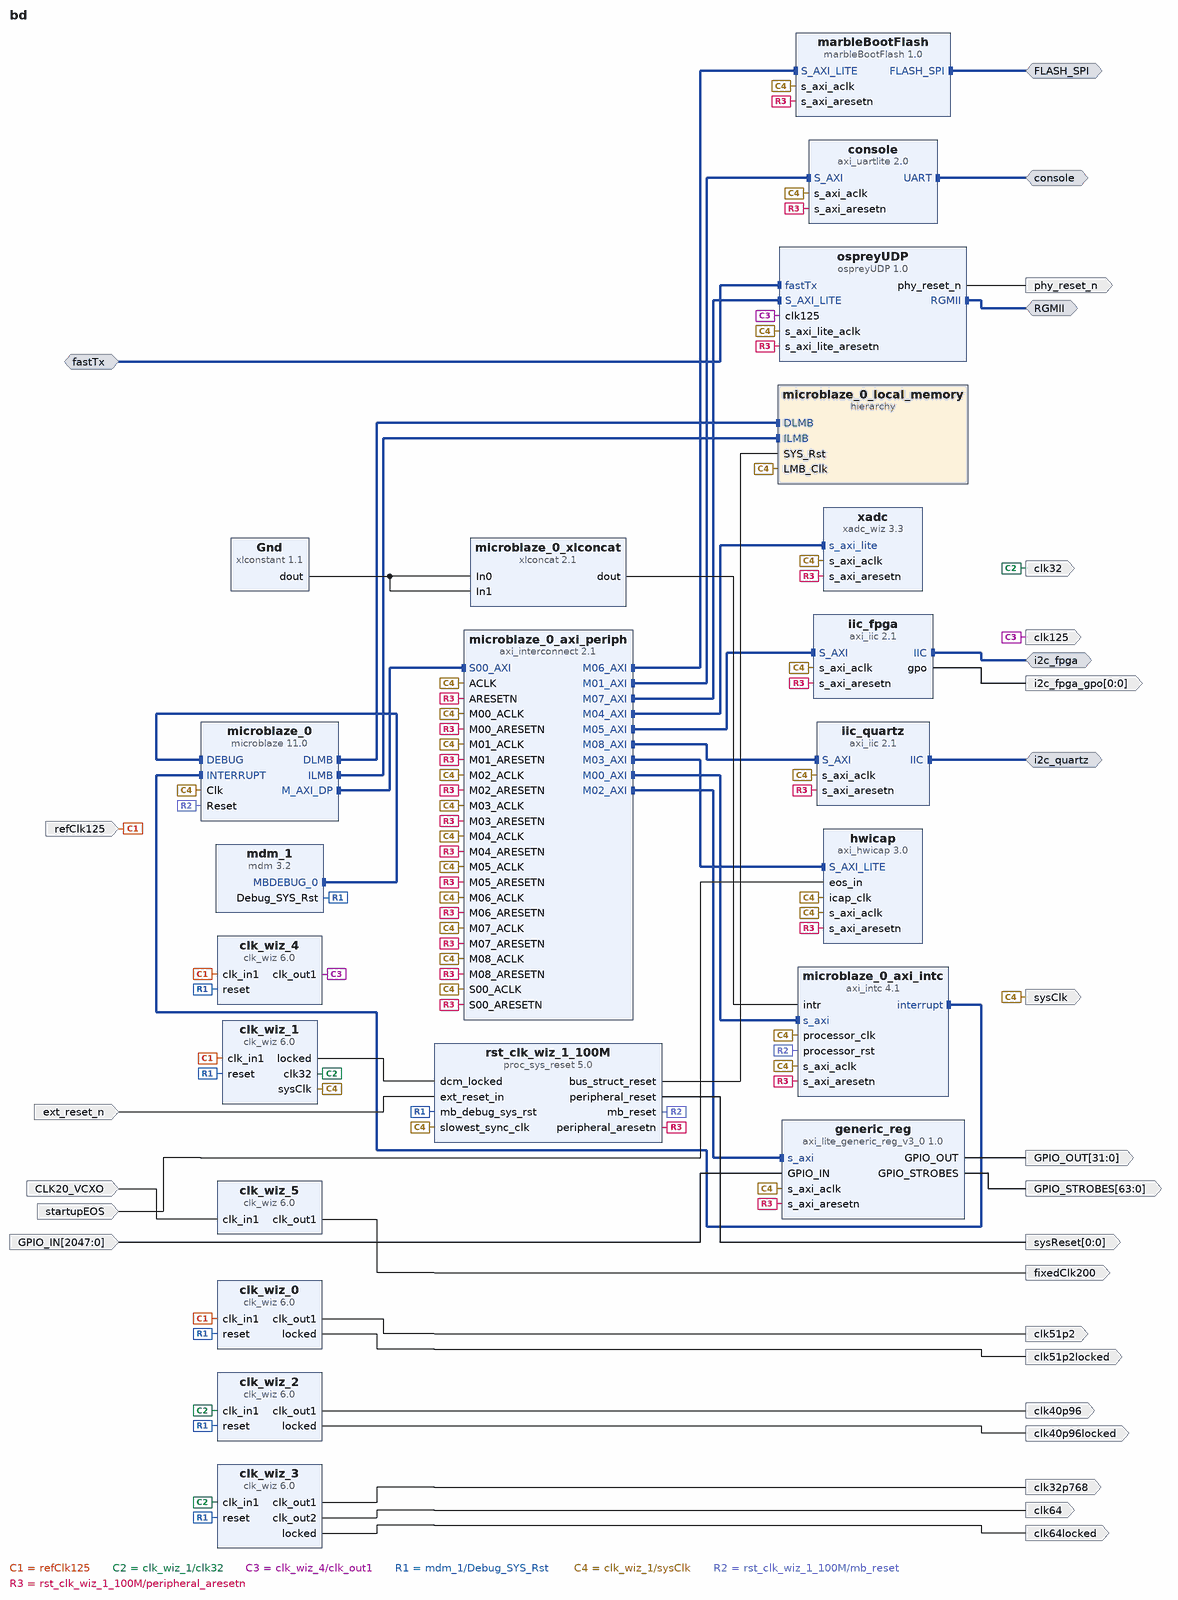
[diagram p0: block diagram of the top level]
# Vivado block design bd, xc7k160tffg676-2, Vivado 2023.1
create_bd_design bd

create_bd_intf_port -mode Master -vlnv xilinx.com:interface:uart_rtl:1.0 console
create_bd_intf_port -mode Master -vlnv xilinx.com:interface:iic_rtl:1.0 i2c_fpga
create_bd_intf_port -mode Master -vlnv OspreyDCS:user:FLASH_SPI_rtl:1.1 FLASH_SPI
create_bd_intf_port -mode Slave -vlnv xilinx.com:interface:axis_rtl:1.0 fastTx
set_property -dict [list \
  CONFIG.HAS_TKEEP 0 \
  CONFIG.HAS_TLAST 1 \
  CONFIG.HAS_TREADY 1 \
  CONFIG.HAS_TSTRB 0 \
  CONFIG.LAYERED_METADATA undef \
  CONFIG.TDATA_NUM_BYTES 1 \
  CONFIG.TDEST_WIDTH 0 \
  CONFIG.TID_WIDTH 0 \
  CONFIG.TUSER_WIDTH 0 \
] [get_bd_intf_ports fastTx]
create_bd_intf_port -mode Master -vlnv xilinx.com:interface:rgmii_rtl:1.0 RGMII
create_bd_intf_port -mode Master -vlnv xilinx.com:interface:iic_rtl:1.0 i2c_quartz
create_bd_port -dir I -type rst ext_reset_n
set_property -dict {CONFIG.POLARITY ACTIVE_LOW} [get_bd_ports ext_reset_n]
create_bd_port -dir O -type clk sysClk
create_bd_port -dir O -from 0 -to 0 -type rst sysReset
create_bd_port -dir O -from 63 -to 0 GPIO_STROBES
create_bd_port -dir O -from 31 -to 0 GPIO_OUT
create_bd_port -dir I -from 2047 -to 0 GPIO_IN
create_bd_port -dir O phy_reset_n
create_bd_port -dir O -from 0 -to 0 i2c_fpga_gpo
create_bd_port -dir O -type clk clk51p2
create_bd_port -dir O -type clk clk40p96
create_bd_port -dir O -type clk clk32p768
create_bd_port -dir O -type clk clk125
set_property -dict {CONFIG.ASSOCIATED_BUSIF fastTx} [get_bd_ports clk125]
create_bd_port -dir I -type clk CLK20_VCXO
set_property -dict {CONFIG.FREQ_HZ 20000000} [get_bd_ports CLK20_VCXO]
create_bd_port -dir O -type clk fixedClk200
create_bd_port -dir O -type clk clk64
create_bd_port -dir O -type clk clk32
set_property -dict {CONFIG.FREQ_HZ 32000000} [get_bd_ports clk32]
create_bd_port -dir I -type clk refClk125
set_property -dict {CONFIG.FREQ_HZ 125000000} [get_bd_ports refClk125]
create_bd_port -dir I startupEOS
create_bd_port -dir O clk51p2locked
create_bd_port -dir O clk40p96locked
create_bd_port -dir O clk64locked

create_bd_cell -type ip -vlnv xilinx.com:ip:microblaze:11.0 microblaze_0
set_property -dict [list \
  CONFIG.C_DEBUG_ENABLED 1 \
  CONFIG.C_D_AXI 1 \
  CONFIG.C_D_LMB 1 \
  CONFIG.C_I_LMB 1 \
  CONFIG.C_USE_BARREL 1 \
  CONFIG.C_USE_DIV 1 \
  CONFIG.C_USE_HW_MUL 1 \
  CONFIG.C_USE_MSR_INSTR 1 \
  CONFIG.C_USE_PCMP_INSTR 1 \
] [get_bd_cells microblaze_0]
create_bd_cell -type hier microblaze_0_local_memory
create_bd_cell -type ip -vlnv xilinx.com:ip:axi_intc:4.1 microblaze_0_axi_intc
set_property -dict {CONFIG.C_HAS_FAST 1} [get_bd_cells microblaze_0_axi_intc]
create_bd_cell -type ip -vlnv xilinx.com:ip:xlconcat:2.1 microblaze_0_xlconcat
create_bd_cell -type ip -vlnv xilinx.com:ip:mdm:3.2 mdm_1
create_bd_cell -type ip -vlnv xilinx.com:ip:clk_wiz:6.0 clk_wiz_1
set_property -dict [list \
  CONFIG.CLKIN1_JITTER_PS 80.0 \
  CONFIG.CLKOUT1_DRIVES BUFG \
  CONFIG.CLKOUT1_JITTER 265.121 \
  CONFIG.CLKOUT1_PHASE_ERROR 265.359 \
  CONFIG.CLKOUT2_DRIVES BUFG \
  CONFIG.CLKOUT2_JITTER 338.714 \
  CONFIG.CLKOUT2_PHASE_ERROR 265.359 \
  CONFIG.CLKOUT2_REQUESTED_OUT_FREQ 32 \
  CONFIG.CLKOUT2_USED true \
  CONFIG.CLKOUT3_DRIVES BUFG \
  CONFIG.CLKOUT3_JITTER 233.189 \
  CONFIG.CLKOUT3_PHASE_ERROR 265.359 \
  CONFIG.CLKOUT3_REQUESTED_OUT_FREQ 200 \
  CONFIG.CLKOUT3_USED false \
  CONFIG.CLKOUT4_DRIVES BUFG \
  CONFIG.CLKOUT5_DRIVES BUFG \
  CONFIG.CLKOUT6_DRIVES BUFG \
  CONFIG.CLKOUT7_DRIVES BUFG \
  CONFIG.CLK_OUT1_PORT sysClk \
  CONFIG.CLK_OUT2_PORT clk32 \
  CONFIG.CLK_OUT3_PORT clk200 \
  CONFIG.MMCM_CLKFBOUT_MULT_F 32.000 \
  CONFIG.MMCM_CLKIN1_PERIOD 8.000 \
  CONFIG.MMCM_CLKIN2_PERIOD 10.000 \
  CONFIG.MMCM_CLKOUT0_DIVIDE_F 8.000 \
  CONFIG.MMCM_CLKOUT1_DIVIDE 25 \
  CONFIG.MMCM_CLKOUT2_DIVIDE 1 \
  CONFIG.MMCM_DIVCLK_DIVIDE 5 \
  CONFIG.NUM_OUT_CLKS 2 \
  CONFIG.PRIM_IN_FREQ 125 \
  CONFIG.PRIM_SOURCE Global_buffer \
  CONFIG.SECONDARY_SOURCE Single_ended_clock_capable_pin \
  CONFIG.USE_PHASE_ALIGNMENT false \
  CONFIG.USE_RESET true \
] [get_bd_cells clk_wiz_1]
create_bd_cell -type ip -vlnv xilinx.com:ip:proc_sys_reset:5.0 rst_clk_wiz_1_100M
create_bd_cell -type ip -vlnv xilinx.com:ip:axi_uartlite:2.0 console
set_property -dict {CONFIG.C_BAUDRATE 115200} [get_bd_cells console]
create_bd_cell -type ip -vlnv xilinx.com:ip:xlconstant:1.1 Gnd
set_property -dict {CONFIG.CONST_VAL 0} [get_bd_cells Gnd]
create_bd_cell -type ip -vlnv xilinx.com:ip:axi_hwicap:3.0 hwicap
create_bd_cell -type ip -vlnv xilinx.com:ip:xadc_wiz:3.3 xadc
set_property -dict [list \
  CONFIG.ADC_CONVERSION_RATE 100 \
  CONFIG.AVERAGE_ENABLE_TEMPERATURE true \
  CONFIG.AVERAGE_ENABLE_VBRAM true \
  CONFIG.AVERAGE_ENABLE_VCCAUX true \
  CONFIG.AVERAGE_ENABLE_VCCINT true \
  CONFIG.CHANNEL_ENABLE_CALIBRATION true \
  CONFIG.CHANNEL_ENABLE_TEMPERATURE true \
  CONFIG.CHANNEL_ENABLE_VBRAM true \
  CONFIG.CHANNEL_ENABLE_VCCAUX true \
  CONFIG.CHANNEL_ENABLE_VCCINT true \
  CONFIG.CHANNEL_ENABLE_VP_VN false \
  CONFIG.EXTERNAL_MUX_CHANNEL VP_VN \
  CONFIG.OT_ALARM false \
  CONFIG.SEQUENCER_MODE Continuous \
  CONFIG.SINGLE_CHANNEL_SELECTION TEMPERATURE \
  CONFIG.USER_TEMP_ALARM false \
  CONFIG.VCCAUX_ALARM false \
  CONFIG.VCCINT_ALARM false \
  CONFIG.XADC_STARUP_SELECTION channel_sequencer \
] [get_bd_cells xadc]
create_bd_cell -type ip -vlnv xilinx.com:ip:axi_iic:2.1 iic_fpga
set_property -dict {CONFIG.C_SCL_INERTIAL_DELAY 30 CONFIG.C_SDA_INERTIAL_DELAY 30} [get_bd_cells iic_fpga]
create_bd_cell -type ip -vlnv ospreydcs.com:user:axi_lite_generic_reg_v3_0:1.0 generic_reg
set_property -dict {CONFIG.C_S_AXI_ADDR_WIDTH 8} [get_bd_cells generic_reg]
create_bd_cell -type ip -vlnv xilinx.com:ip:clk_wiz:6.0 clk_wiz_0
set_property -dict [list \
  CONFIG.CLKOUT1_JITTER 304.149 \
  CONFIG.CLKOUT1_PHASE_ERROR 265.359 \
  CONFIG.CLKOUT1_REQUESTED_OUT_FREQ 51.2 \
  CONFIG.MMCM_CLKFBOUT_MULT_F 32.000 \
  CONFIG.MMCM_CLKOUT0_DIVIDE_F 15.625 \
  CONFIG.MMCM_DIVCLK_DIVIDE 5 \
  CONFIG.PRIM_SOURCE Global_buffer \
  CONFIG.USE_LOCKED true \
] [get_bd_cells clk_wiz_0]
create_bd_cell -type ip -vlnv xilinx.com:ip:clk_wiz:6.0 clk_wiz_2
set_property -dict [list \
  CONFIG.CLKIN1_JITTER_PS 312.5 \
  CONFIG.CLKOUT1_JITTER 258.106 \
  CONFIG.CLKOUT1_PHASE_ERROR 198.711 \
  CONFIG.CLKOUT1_REQUESTED_OUT_FREQ 40.96 \
  CONFIG.MMCM_CLKFBOUT_MULT_F 32.000 \
  CONFIG.MMCM_CLKIN1_PERIOD 31.250 \
  CONFIG.MMCM_CLKIN2_PERIOD 10.0 \
  CONFIG.MMCM_CLKOUT0_DIVIDE_F 25.000 \
  CONFIG.MMCM_DIVCLK_DIVIDE 1 \
  CONFIG.PRIM_SOURCE Global_buffer \
  CONFIG.USE_LOCKED true \
] [get_bd_cells clk_wiz_2]
create_bd_cell -type ip -vlnv xilinx.com:ip:clk_wiz:6.0 clk_wiz_3
set_property -dict [list \
  CONFIG.CLKOUT1_JITTER 278.816 \
  CONFIG.CLKOUT1_PHASE_ERROR 198.711 \
  CONFIG.CLKOUT1_REQUESTED_OUT_FREQ 32.768 \
  CONFIG.CLKOUT2_JITTER 225.122 \
  CONFIG.CLKOUT2_PHASE_ERROR 198.711 \
  CONFIG.CLKOUT2_REQUESTED_OUT_FREQ 64 \
  CONFIG.CLKOUT2_USED true \
  CONFIG.MMCM_CLKFBOUT_MULT_F 32.000 \
  CONFIG.MMCM_CLKOUT0_DIVIDE_F 31.250 \
  CONFIG.MMCM_CLKOUT1_DIVIDE 16 \
  CONFIG.MMCM_DIVCLK_DIVIDE 1 \
  CONFIG.NUM_OUT_CLKS 2 \
  CONFIG.PRIM_SOURCE Global_buffer \
  CONFIG.USE_LOCKED true \
] [get_bd_cells clk_wiz_3]
create_bd_cell -type ip -vlnv xilinx.com:ip:clk_wiz:6.0 clk_wiz_4
set_property -dict [list \
  CONFIG.CLKOUT1_JITTER 119.348 \
  CONFIG.CLKOUT1_REQUESTED_OUT_FREQ 125 \
  CONFIG.MMCM_CLKOUT0_DIVIDE_F 8.000 \
  CONFIG.PRIM_SOURCE Global_buffer \
  CONFIG.USE_LOCKED false \
] [get_bd_cells clk_wiz_4]
create_bd_cell -type ip -vlnv xilinx.com:ip:clk_wiz:6.0 clk_wiz_5
set_property -dict [list \
  CONFIG.CLKOUT1_JITTER 237.367 \
  CONFIG.CLKOUT1_REQUESTED_OUT_FREQ 200 \
  CONFIG.MMCM_CLKOUT0_DIVIDE_F 5.000 \
  CONFIG.USE_LOCKED false \
  CONFIG.USE_RESET false \
] [get_bd_cells clk_wiz_5]
create_bd_cell -type ip -vlnv user.org:user:ospreyUDP:1.0 ospreyUDP
set_property -dict [list \
  CONFIG.DEBUG_RX_MAC false \
  CONFIG.DEBUG_TX_FAST false \
  CONFIG.DEBUG_TX_MAC false \
  CONFIG.DEBUG_TX_UDP false \
  CONFIG.ENABLE_ICMP_ECHO false \
  CONFIG.RX_FIFO_DEPTH 16384 \
] [get_bd_cells ospreyUDP]
create_bd_cell -type ip -vlnv user.org:user:marbleBootFlash:1.0 marbleBootFlash
set_property -dict {CONFIG.DEBUG false} [get_bd_cells marbleBootFlash]
create_bd_cell -type ip -vlnv xilinx.com:ip:axi_iic:2.1 iic_quartz
set_property -dict {CONFIG.C_SCL_INERTIAL_DELAY 30 CONFIG.C_SDA_INERTIAL_DELAY 30} [get_bd_cells iic_quartz]
create_bd_cell -type ip -vlnv xilinx.com:ip:axi_interconnect:2.1 microblaze_0_axi_periph
set_property -dict {CONFIG.NUM_MI 9} [get_bd_cells microblaze_0_axi_periph]

# ---- hierarchy /microblaze_0_local_memory ----
current_bd_instance /microblaze_0_local_memory
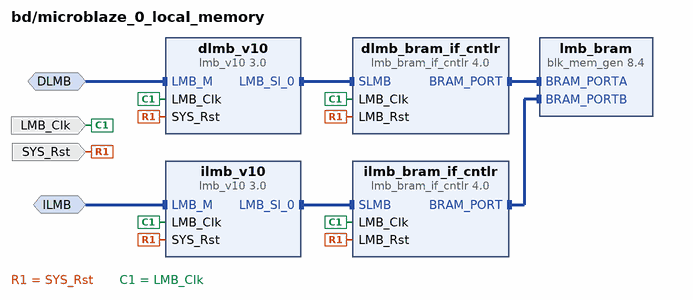
[diagram p1: block diagram inside /microblaze_0_local_memory]
create_bd_intf_pin -mode MirroredMaster -vlnv xilinx.com:interface:lmb_rtl:1.0 DLMB
create_bd_intf_pin -mode MirroredMaster -vlnv xilinx.com:interface:lmb_rtl:1.0 ILMB
create_bd_pin -dir I -type clk LMB_Clk
create_bd_pin -dir I -type rst SYS_Rst

create_bd_cell -type ip -vlnv xilinx.com:ip:lmb_v10:3.0 dlmb_v10
create_bd_cell -type ip -vlnv xilinx.com:ip:lmb_v10:3.0 ilmb_v10
create_bd_cell -type ip -vlnv xilinx.com:ip:lmb_bram_if_cntlr:4.0 dlmb_bram_if_cntlr
set_property -dict {CONFIG.C_ECC 0} [get_bd_cells dlmb_bram_if_cntlr]
create_bd_cell -type ip -vlnv xilinx.com:ip:lmb_bram_if_cntlr:4.0 ilmb_bram_if_cntlr
set_property -dict {CONFIG.C_ECC 0} [get_bd_cells ilmb_bram_if_cntlr]
create_bd_cell -type ip -vlnv xilinx.com:ip:blk_mem_gen:8.4 lmb_bram
set_property -dict {CONFIG.Memory_Type True_Dual_Port_RAM CONFIG.use_bram_block BRAM_Controller} [get_bd_cells lmb_bram]

# ---- connections ----

current_bd_instance /microblaze_0_local_memory
connect_bd_intf_net -intf_net microblaze_0_dlmb [get_bd_intf_pins dlmb_v10/LMB_M] [get_bd_intf_pins DLMB]
connect_bd_intf_net -intf_net microblaze_0_dlmb_bus [get_bd_intf_pins dlmb_v10/LMB_Sl_0] [get_bd_intf_pins dlmb_bram_if_cntlr/SLMB]
connect_bd_intf_net -intf_net microblaze_0_dlmb_cntlr [get_bd_intf_pins dlmb_bram_if_cntlr/BRAM_PORT] [get_bd_intf_pins lmb_bram/BRAM_PORTA]
connect_bd_intf_net -intf_net microblaze_0_ilmb [get_bd_intf_pins ilmb_v10/LMB_M] [get_bd_intf_pins ILMB]
connect_bd_intf_net -intf_net microblaze_0_ilmb_bus [get_bd_intf_pins ilmb_v10/LMB_Sl_0] [get_bd_intf_pins ilmb_bram_if_cntlr/SLMB]
connect_bd_intf_net -intf_net microblaze_0_ilmb_cntlr [get_bd_intf_pins ilmb_bram_if_cntlr/BRAM_PORT] [get_bd_intf_pins lmb_bram/BRAM_PORTB]
connect_bd_net [get_bd_pins SYS_Rst] \
  [get_bd_pins dlmb_v10/SYS_Rst] [get_bd_pins dlmb_bram_if_cntlr/LMB_Rst] [get_bd_pins ilmb_v10/SYS_Rst] \
  [get_bd_pins ilmb_bram_if_cntlr/LMB_Rst]
connect_bd_net -net microblaze_0_Clk [get_bd_pins LMB_Clk] \
  [get_bd_pins dlmb_v10/LMB_Clk] [get_bd_pins dlmb_bram_if_cntlr/LMB_Clk] [get_bd_pins ilmb_v10/LMB_Clk] \
  [get_bd_pins ilmb_bram_if_cntlr/LMB_Clk]
set_property HDL_ATTRIBUTE.BMM_INFO_ADDRESS_SPACE {byte  0x00000000 32 > bd microblaze_0_local_memory/lmb_bram} [get_bd_cells dlmb_bram_if_cntlr]
set_property HDL_ATTRIBUTE.KEEP_HIERARCHY yes [get_bd_cells dlmb_bram_if_cntlr]

current_bd_instance /
connect_bd_intf_net -intf_net axi_iic_0_IIC [get_bd_intf_ports i2c_fpga] [get_bd_intf_pins iic_fpga/IIC]
connect_bd_intf_net -intf_net axi_iic_0_IIC1 [get_bd_intf_ports i2c_quartz] [get_bd_intf_pins iic_quartz/IIC]
connect_bd_intf_net -intf_net axi_uartlite_0_UART [get_bd_intf_ports console] [get_bd_intf_pins console/UART]
connect_bd_intf_net -intf_net fastTx_0_1 [get_bd_intf_ports fastTx] [get_bd_intf_pins ospreyUDP/fastTx]
connect_bd_intf_net [get_bd_intf_ports FLASH_SPI] [get_bd_intf_pins marbleBootFlash/FLASH_SPI]
connect_bd_intf_net -intf_net microblaze_0_axi_dp [get_bd_intf_pins microblaze_0_axi_periph/S00_AXI] [get_bd_intf_pins microblaze_0/M_AXI_DP]
connect_bd_intf_net [get_bd_intf_pins microblaze_0_axi_periph/M01_AXI] [get_bd_intf_pins console/S_AXI]
connect_bd_intf_net [get_bd_intf_pins microblaze_0_axi_periph/M02_AXI] [get_bd_intf_pins generic_reg/s_axi]
connect_bd_intf_net [get_bd_intf_pins microblaze_0_axi_periph/M03_AXI] [get_bd_intf_pins hwicap/S_AXI_LITE]
connect_bd_intf_net [get_bd_intf_pins microblaze_0_axi_periph/M04_AXI] [get_bd_intf_pins xadc/s_axi_lite]
connect_bd_intf_net [get_bd_intf_pins microblaze_0_axi_periph/M05_AXI] [get_bd_intf_pins iic_fpga/S_AXI]
connect_bd_intf_net [get_bd_intf_pins microblaze_0_axi_periph/M06_AXI] [get_bd_intf_pins marbleBootFlash/S_AXI_LITE]
connect_bd_intf_net [get_bd_intf_pins microblaze_0_axi_periph/M07_AXI] [get_bd_intf_pins ospreyUDP/S_AXI_LITE]
connect_bd_intf_net [get_bd_intf_pins microblaze_0_axi_periph/M08_AXI] [get_bd_intf_pins iic_quartz/S_AXI]
connect_bd_intf_net [get_bd_intf_pins mdm_1/MBDEBUG_0] [get_bd_intf_pins microblaze_0/DEBUG]
connect_bd_intf_net [get_bd_intf_pins microblaze_0/DLMB] [get_bd_intf_pins microblaze_0_local_memory/DLMB]
connect_bd_intf_net [get_bd_intf_pins microblaze_0/ILMB] [get_bd_intf_pins microblaze_0_local_memory/ILMB]
connect_bd_intf_net -intf_net microblaze_0_intc_axi [get_bd_intf_pins microblaze_0_axi_periph/M00_AXI] [get_bd_intf_pins microblaze_0_axi_intc/s_axi]
connect_bd_intf_net [get_bd_intf_pins microblaze_0_axi_intc/interrupt] [get_bd_intf_pins microblaze_0/INTERRUPT]
connect_bd_intf_net -intf_net ospreyUDP_0_RGMII [get_bd_intf_ports RGMII] [get_bd_intf_pins ospreyUDP/RGMII]
connect_bd_net -net GPIO_IN_0_1 [get_bd_ports GPIO_IN] [get_bd_pins generic_reg/GPIO_IN]
connect_bd_net [get_bd_pins Gnd/dout] [get_bd_pins microblaze_0_xlconcat/In0] [get_bd_pins microblaze_0_xlconcat/In1]
connect_bd_net -net axi_lite_generic_reg_0_GPIO_OUT [get_bd_pins generic_reg/GPIO_OUT] [get_bd_ports GPIO_OUT]
connect_bd_net -net axi_lite_generic_reg_0_GPIO_STROBES [get_bd_pins generic_reg/GPIO_STROBES] [get_bd_ports GPIO_STROBES]
connect_bd_net -net clk_in1_0_1 [get_bd_ports CLK20_VCXO] [get_bd_pins clk_wiz_5/clk_in1]
connect_bd_net -net clk_in1_0_2 [get_bd_ports refClk125] \
  [get_bd_pins clk_wiz_1/clk_in1] [get_bd_pins clk_wiz_4/clk_in1] [get_bd_pins clk_wiz_0/clk_in1]
connect_bd_net [get_bd_pins clk_wiz_0/clk_out1] [get_bd_ports clk51p2]
connect_bd_net [get_bd_pins clk_wiz_0/locked] [get_bd_ports clk51p2locked]
connect_bd_net [get_bd_pins clk_wiz_1/clk32] [get_bd_pins clk_wiz_2/clk_in1] [get_bd_pins clk_wiz_3/clk_in1] [get_bd_ports clk32]
connect_bd_net [get_bd_pins clk_wiz_1/locked] [get_bd_pins rst_clk_wiz_1_100M/dcm_locked]
connect_bd_net [get_bd_pins clk_wiz_2/clk_out1] [get_bd_ports clk40p96]
connect_bd_net [get_bd_pins clk_wiz_2/locked] [get_bd_ports clk40p96locked]
connect_bd_net [get_bd_pins clk_wiz_3/clk_out1] [get_bd_ports clk32p768]
connect_bd_net [get_bd_pins clk_wiz_3/clk_out2] [get_bd_ports clk64]
connect_bd_net [get_bd_pins clk_wiz_3/locked] [get_bd_ports clk64locked]
connect_bd_net [get_bd_pins clk_wiz_4/clk_out1] [get_bd_ports clk125] [get_bd_pins ospreyUDP/clk125]
connect_bd_net [get_bd_pins clk_wiz_5/clk_out1] [get_bd_ports fixedClk200]
connect_bd_net -net eos_in_0_1 [get_bd_ports startupEOS] [get_bd_pins hwicap/eos_in]
connect_bd_net [get_bd_pins iic_fpga/gpo] [get_bd_ports i2c_fpga_gpo]
connect_bd_net [get_bd_pins mdm_1/Debug_SYS_Rst] \
  [get_bd_pins rst_clk_wiz_1_100M/mb_debug_sys_rst] [get_bd_pins clk_wiz_1/reset] [get_bd_pins clk_wiz_0/reset] \
  [get_bd_pins clk_wiz_2/reset] [get_bd_pins clk_wiz_3/reset] [get_bd_pins clk_wiz_4/reset]
connect_bd_net -net microblaze_0_Clk [get_bd_pins clk_wiz_1/sysClk] \
  [get_bd_pins microblaze_0/Clk] [get_bd_pins microblaze_0_axi_intc/s_axi_aclk] \
  [get_bd_pins microblaze_0_axi_intc/processor_clk] [get_bd_pins microblaze_0_local_memory/LMB_Clk] \
  [get_bd_pins rst_clk_wiz_1_100M/slowest_sync_clk] [get_bd_pins console/s_axi_aclk] [get_bd_ports sysClk] \
  [get_bd_pins hwicap/s_axi_aclk] [get_bd_pins xadc/s_axi_aclk] [get_bd_pins hwicap/icap_clk] \
  [get_bd_pins iic_fpga/s_axi_aclk] [get_bd_pins generic_reg/s_axi_aclk] [get_bd_pins ospreyUDP/s_axi_lite_aclk] \
  [get_bd_pins marbleBootFlash/s_axi_aclk] [get_bd_pins iic_quartz/s_axi_aclk] [get_bd_pins microblaze_0_axi_periph/ACLK] \
  [get_bd_pins microblaze_0_axi_periph/S00_ACLK] [get_bd_pins microblaze_0_axi_periph/M00_ACLK] \
  [get_bd_pins microblaze_0_axi_periph/M01_ACLK] [get_bd_pins microblaze_0_axi_periph/M02_ACLK] \
  [get_bd_pins microblaze_0_axi_periph/M03_ACLK] [get_bd_pins microblaze_0_axi_periph/M04_ACLK] \
  [get_bd_pins microblaze_0_axi_periph/M05_ACLK] [get_bd_pins microblaze_0_axi_periph/M06_ACLK] \
  [get_bd_pins microblaze_0_axi_periph/M07_ACLK] [get_bd_pins microblaze_0_axi_periph/M08_ACLK]
connect_bd_net -net microblaze_0_intr [get_bd_pins microblaze_0_xlconcat/dout] [get_bd_pins microblaze_0_axi_intc/intr]
connect_bd_net -net ospreyUDP_0_phy_reset_n [get_bd_pins ospreyUDP/phy_reset_n] [get_bd_ports phy_reset_n]
connect_bd_net -net reset_rtl_0_1 [get_bd_ports ext_reset_n] [get_bd_pins rst_clk_wiz_1_100M/ext_reset_in]
connect_bd_net [get_bd_pins rst_clk_wiz_1_100M/bus_struct_reset] [get_bd_pins microblaze_0_local_memory/SYS_Rst]
connect_bd_net [get_bd_pins rst_clk_wiz_1_100M/mb_reset] [get_bd_pins microblaze_0/Reset] [get_bd_pins microblaze_0_axi_intc/processor_rst]
connect_bd_net [get_bd_pins rst_clk_wiz_1_100M/peripheral_aresetn] \
  [get_bd_pins microblaze_0_axi_intc/s_axi_aresetn] [get_bd_pins console/s_axi_aresetn] [get_bd_pins hwicap/s_axi_aresetn] \
  [get_bd_pins xadc/s_axi_aresetn] [get_bd_pins iic_fpga/s_axi_aresetn] [get_bd_pins generic_reg/s_axi_aresetn] \
  [get_bd_pins ospreyUDP/s_axi_lite_aresetn] [get_bd_pins marbleBootFlash/s_axi_aresetn] \
  [get_bd_pins iic_quartz/s_axi_aresetn] [get_bd_pins microblaze_0_axi_periph/ARESETN] \
  [get_bd_pins microblaze_0_axi_periph/S00_ARESETN] [get_bd_pins microblaze_0_axi_periph/M00_ARESETN] \
  [get_bd_pins microblaze_0_axi_periph/M01_ARESETN] [get_bd_pins microblaze_0_axi_periph/M02_ARESETN] \
  [get_bd_pins microblaze_0_axi_periph/M03_ARESETN] [get_bd_pins microblaze_0_axi_periph/M04_ARESETN] \
  [get_bd_pins microblaze_0_axi_periph/M05_ARESETN] [get_bd_pins microblaze_0_axi_periph/M06_ARESETN] \
  [get_bd_pins microblaze_0_axi_periph/M07_ARESETN] [get_bd_pins microblaze_0_axi_periph/M08_ARESETN]
connect_bd_net [get_bd_pins rst_clk_wiz_1_100M/peripheral_reset] [get_bd_ports sysReset]
set_property HDL_ATTRIBUTE.BMM_INFO_PROCESSOR {microblaze-le > bd microblaze_0_local_memory/dlmb_bram_if_cntlr} [get_bd_cells microblaze_0]
set_property HDL_ATTRIBUTE.KEEP_HIERARCHY yes [get_bd_cells microblaze_0]

# ---- address map ----
assign_bd_address -offset 0x00000000 -range 128K -target_address_space [get_bd_addr_spaces microblaze_0/Data] [get_bd_addr_segs microblaze_0_local_memory/dlmb_bram_if_cntlr/SLMB/Mem]
assign_bd_address -offset 0x40200000 -range 64K -target_address_space [get_bd_addr_spaces microblaze_0/Data] [get_bd_addr_segs hwicap/S_AXI_LITE/Reg]
assign_bd_address -offset 0x40600000 -range 64K -target_address_space [get_bd_addr_spaces microblaze_0/Data] [get_bd_addr_segs console/S_AXI/Reg]
assign_bd_address -offset 0x40800000 -range 64K -target_address_space [get_bd_addr_spaces microblaze_0/Data] [get_bd_addr_segs iic_fpga/S_AXI/Reg]
assign_bd_address -offset 0x40810000 -range 64K -target_address_space [get_bd_addr_spaces microblaze_0/Data] [get_bd_addr_segs iic_quartz/S_AXI/Reg]
assign_bd_address -offset 0x41200000 -range 64K -target_address_space [get_bd_addr_spaces microblaze_0/Data] [get_bd_addr_segs microblaze_0_axi_intc/S_AXI/Reg]
assign_bd_address -offset 0x44A00000 -range 64K -target_address_space [get_bd_addr_spaces microblaze_0/Data] [get_bd_addr_segs generic_reg/s_axi/reg0]
assign_bd_address -offset 0x44A10000 -range 64K -target_address_space [get_bd_addr_spaces microblaze_0/Data] [get_bd_addr_segs xadc/s_axi_lite/Reg]
assign_bd_address -offset 0x44A20000 -range 64K -target_address_space [get_bd_addr_spaces microblaze_0/Data] [get_bd_addr_segs marbleBootFlash/S_AXI_LITE/S_AXI_LITE_reg]
assign_bd_address -offset 0x44A30000 -range 64K -target_address_space [get_bd_addr_spaces microblaze_0/Data] [get_bd_addr_segs ospreyUDP/S_AXI_LITE/S_AXI_LITE_reg]
assign_bd_address -offset 0x00000000 -range 128K -target_address_space [get_bd_addr_spaces microblaze_0/Instruction] [get_bd_addr_segs microblaze_0_local_memory/ilmb_bram_if_cntlr/SLMB/Mem]

validate_bd_design
save_bd_design
